# Altium schematic sheet Data Connector.SchDoc
size A; SheetNumber: 3; SheetTotal: 6
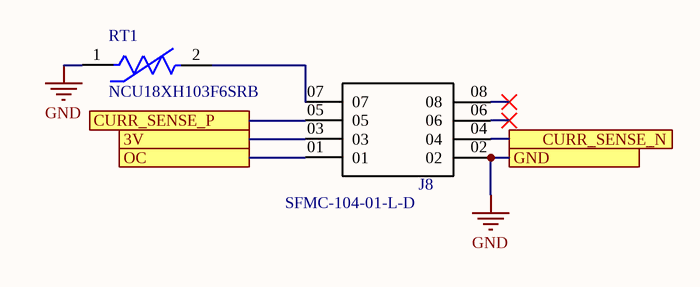
[diagram p0: Data Connector.SchDoc]

## Parts
J8  SFMC-104-01-L-D  [*SAMTEC_SFMC-104-01-L-D_SFMC-104-01-L-D(Primary)]
RT1  NCU18XH103F6SRB  [FP-NCU18-0_15-IPC_B]

## Ports
3V, CURR_SENSE_N, CURR_SENSE_P, GND, OC

## Nets
GND: J8.02 RT1.1 ; port GND
3V: J8.03 ; port 3V
CURR_SENSE_N: J8.04 ; port CURR_SENSE_N
CURR_SENSE_P: J8.05 ; port CURR_SENSE_P
OC: J8.01 ; port OC
NetJ8_07: J8.07 RT1.2

Not connected (* = marked no-connect by the designer): J8 06* 08*

## Library data of the parts
RT1 = CMP-06022-000547-2: THERMISTOR NTC; Min Operating Temperature: -40°C; Case Code (Metric): 1608; Max Operating Temperature: 150°C; RoHS Compliant: Yes; Case/Package: 0603; Case Code (Imperial): 0603; REACH SVHC: No SVHC
J8 = SFMC-104-01-L-D: Value: *